# EAGLE design PAT9125_Breakout (EAGLE 9.6.2)
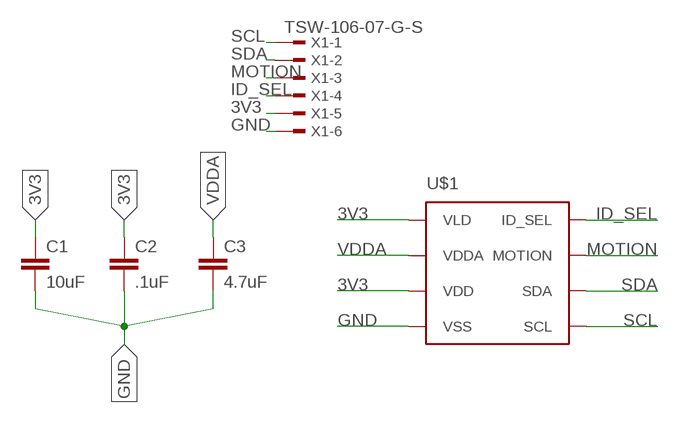
[diagram p0: schematic, sheet 1]

## Parts
C1  10uF  C-EUC0603  [C0603]
C2  .1uF  C-EUC0603  [C0603]
C3  4.7uF  C-EUC0603  [C0603]
U$1  PAT9125EL  [PAT9125EL]
X1  TSW-106-07-G-S  [TSW-106-XX-G-S]

## Nets
3V3: C1.1 C2.1 U$1.P$1(VLD) U$1.P$3(VDD) X1.5
GND: C1.2 C2.2 C3.2 U$1.P$4(VSS) X1.6
ID_SEL: U$1.P$8(ID_SEL) X1.4
MOTION: U$1.P$7(MOTION) X1.3
SCL: U$1.P$5(SCL) X1.1
SDA: U$1.P$6(SDA) X1.2
VDDA: C3.1 U$1.P$2(VDDA)

## Library data of the parts
C1-C3 = rcl:C-EU: CAPACITOR, European symbol; SPICEPREFIX: C
U$1 = Limbo:PAT9125EL
X1 = con-samtec:TSW-106-*-G-S: THROUGH-HOLE .025" SQ POST HEADER Source: Samtec TSW.pdf; MF: Samtec Inc.; MPN: TSW-106-07-G-S

## Net classes
0 default: width 0.305 mm, drill 0.508 mm, clearance 0.254 mm

## Board
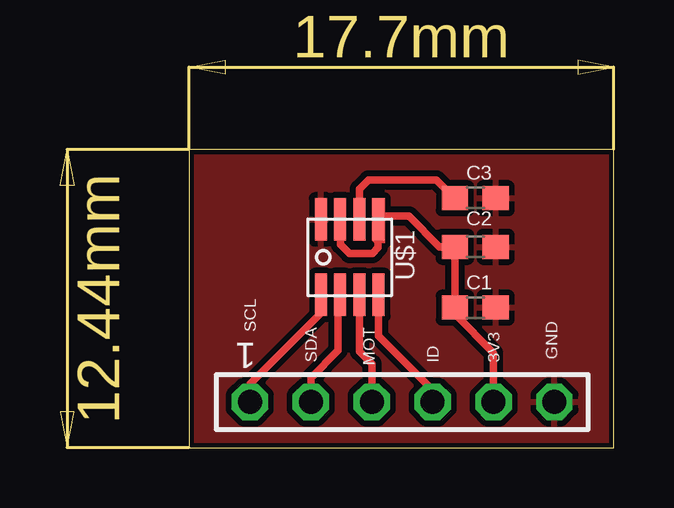
[diagram p1: board, top side]
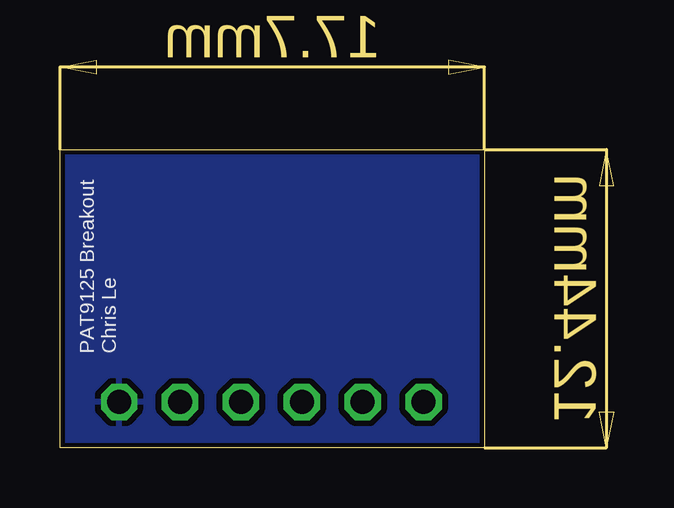
[diagram p2: board, bottom side, seen from below]

Size 17.7 x 12.44 mm. Coordinates in mm from the lower left corner, seen from the top.
Outline: 0,0 17.7,0 17.7,12.44 0,12.44 0,0
Copper layers (1*16): Top 0.035mm / dielectric 1.6mm / Bottom 0.035mm
Design rules "designrulecheck_jlcpcb_2layers": minimum track width 5mil, minimum drill 0.3mm, track to track 5mil, track to pad 0.2mm, pad to pad 5mil, via to via 10mil, smd to smd 5mil, copper to edge 0.2mm, drill to drill 0.5mm, minimum pad ring 10mil, minimum via ring 0.3mm, stop-mask expansion 4mil, vias tented up to drill 0mil, thermal gap 10mil

### Footprints (pad centres in the part's own frame; a part is rotated, then mirrored left to right if it is on the bottom)
C0603 = smd 1.1 x 1: 1 -0.85,0; 2 0.85,0
PAT9125EL = smd 0.5 x 1.756: P$1 2.95,3.178 | smd 0.5 x 1.766: P$2 2.15,3.173; P$3 1.35,3.173; P$4 0.55,3.173; P$5 0.55,0.027; P$6 1.35,0.027; P$7 2.15,0.027; P$8 2.95,0.027
TSW-106-XX-G-S = drill 1 pad 1.5 octagon: 1 6.35,0; 2 3.81,0; 3 1.27,0; 4 -1.27,0; 5 -3.81,0; 6 -6.35,0

### Placement (x,y rotation side)
C1  11.94,5.84 0 top
C2  11.94,8.38 0 top
C3  11.94,10.41 0 top
U$1  4.95,6.35 0 top
X1  8.89,1.91 180 top

### Tracks (layer width: path | path; a pad name or v marks a point on that pad's centre or on a via)
3V3
  Top 0.305: X1.5 12.7,3.96 11.09,5.57 C1.1 C2.1 10.45,8.38 9.17,9.66 8.03,9.66 U$1.P$1 8.02,9.41 7.89,9.28 7.89,8.34 7.65,8.11 6.69,8.11 6.32,8.47 6.32,9.51 U$1.P$3
GND
  pour Top: -2.54,22.22 -2.54,-1.9 21.59,-1.9 21.59,22.22
  pour Bottom: -2.54,20.95 -2.54,-1.9 20.32,-1.9 20.32,22.22 -2.54,22.22
ID_SEL
  Top 0.305: X1.4 10.16,2.41 7.9,4.67 U$1.P$8
MOTION
  Top 0.305: X1.3 7.62,3.5 7.11,4.01 7.11,6.36 U$1.P$7
SCL
  Top 0.305: X1.1 2.54,2.67 5.5,5.63 U$1.P$5
SDA
  Top 0.305: U$1.P$6 6.22,6.3 6.22,4.06 5.08,2.92 X1.2
VDDA
  Top 0.305: U$1.P$2 7.1,10.79 7.48,11.17 10.33,11.17 C3.1

### Text on the board
tNames: SCL | SDA | MOT | ID | 3V3 | GND
bNames: PAT9125 Breakout / Chris Le